# EasyEDA Pro project 空调遥控板.epro

# Schematic 空调遥控板
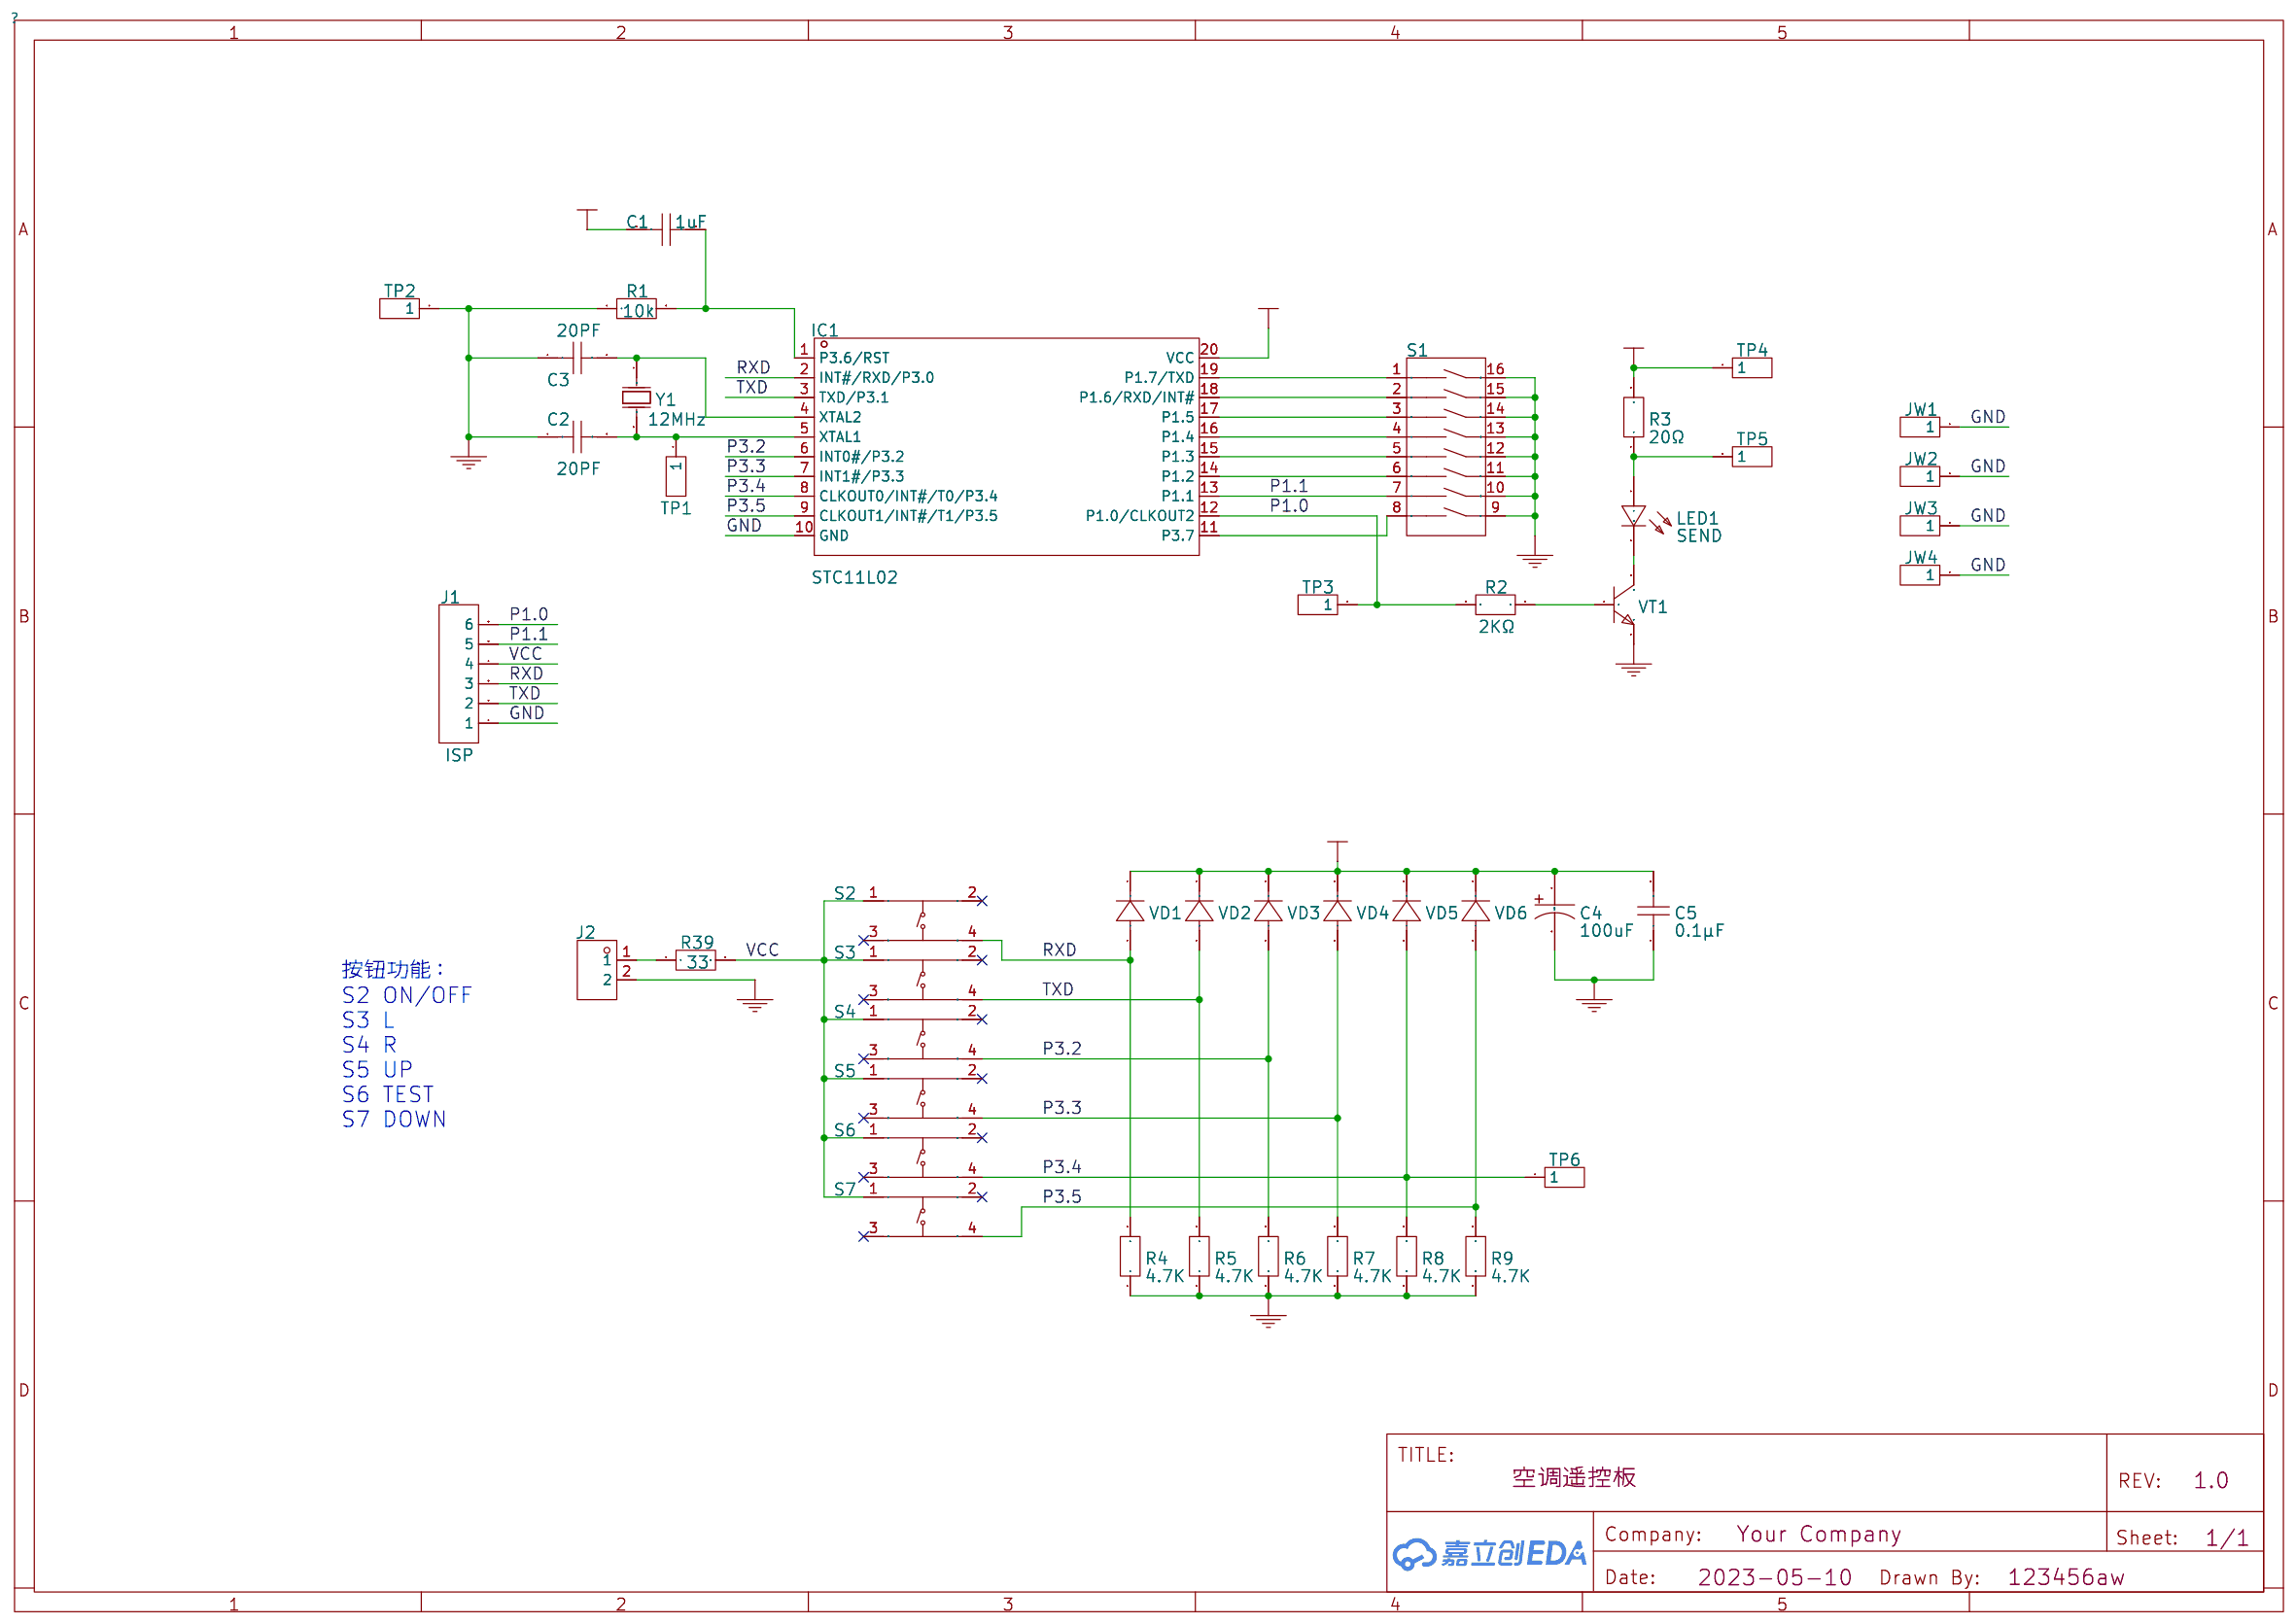
[diagram p0: schematic sheet]

## Parts
C1  1uF  [C0805]
C2  20PF  [C0805]
C3  20PF  [C0805]
C4  100uF  [CASE-C_6032]
C5  0.1μF  [C0805]
IC1  STC11L02  [SOIC-20_L13.0-W7.6-P1.27-LS10.3-BL]
J1  ISP  [HDR-F-2.54_1X6]
J2  +3V GND  [CONN-TH_HX20020-2A]
JW1  HDR-M-2.54_1x1  [焊盘M3]
JW2  HDR-M-2.54_1x1  [焊盘M3]
JW3  HDR-M-2.54_1x1  [焊盘M3]
JW4  HDR-M-2.54_1x1  [焊盘M3]
LED1  SEND  [LED-TH_BD3.9-P2.54-FD]
R1  10k  [R0805]
R2  2KΩ  [R0805]
R3  20Ω  [RES-TH_BD3.5-L9.0-P13.00-D0.5]
R4  4.7K  [R0805]
R5  4.7K  [R0805]
R6  4.7K  [R0805]
R7  4.7K  [R0805]
R8  4.7K  [R0805]
R9  4.7K  [R0805]
R39  33  [R0805]
S1  ADD  [SW-TH_16P-L21.9-W9.9-P2.54-LS7.8]
S2  ON/OFF  [SW-TH_4P-L6.0-W6.0-P4.50-LS6.5]
S3  L  [SW-TH_4P-L6.0-W6.0-P4.50-LS6.5]
S4  R  [SW-TH_4P-L6.0-W6.0-P4.50-LS6.5]
S5  UP  [SW-TH_4P-L6.0-W6.0-P4.50-LS6.5]
S6  TEST  [SW-TH_4P-L6.0-W6.0-P4.50-LS6.5]
S7  DOWM  [SW-TH_4P-L6.0-W6.0-P4.50-LS6.5]
TP1  XTAL  [HDR-M-2.54_1X1]
TP2  GND  [HDR-M-2.54_1X1]
TP3  SEND  [HDR-M-2.54_1X1]
TP4  VCC  [HDR-M-2.54_1X1]
TP5  RS  [HDR-M-2.54_1X1]
TP6  TEST  [HDR-M-2.54_1X1]
VD1  1N5819_C9900008009  [SMA_L4.3-W2.6-LS5.1-RD]
VD2  1N5819_C9900008009  [SMA_L4.3-W2.6-LS5.1-RD]
VD3  1N5819_C9900008009  [SMA_L4.3-W2.6-LS5.1-RD]
VD4  1N5819_C9900008009  [SMA_L4.3-W2.6-LS5.1-RD]
VD5  1N5819_C9900008009  [SMA_L4.3-W2.6-LS5.1-RD]
VD6  1N5819_C9900008009  [SMA_L4.3-W2.6-LS5.1-RD]
VT1  S8050_C105433  [SOT-23-3_L2.9-W1.6-P1.90-LS2.8-BR]
Y1  12MHz  [HC-49US_L11.5-W4.5-P4.88]

## Library data of the parts
C1 = 1uF: link: https://item.szlcsc.com/373011.html; 3DModel: C0805_L2.0-W1.3-H1.3
C2 C3 = 20PF: link: https://item.szlcsc.com/373011.html; 3DModel: C0805_L2.0-W1.3-H1.3
C4 = 100uF: link: https://atta.szlcsc.com/upload/public/pdf/source/20191107/C444803_2AE3212B584342380EA93CBE13ACED9E.pdf; 3DModel: CASE-C_L6.0-W3.2-H2.7; Supplier: LCSC; Supplier Part: C273664; Manufacturer: Kyocera AVX; Manufacturer Part: F931C107KCC; JLCPCB Part Class: Extended Part
C5 = 0.1μF: link: https://item.szlcsc.com/373011.html; 3DModel: C0805_L2.0-W1.3-H1.3
IC1 = STC11L02: link: https://so.szlcsc.com/global.html?k=C32412&amp;ref=editor; 3DModel: SOIC-20_L12.8-W7.5-H2.7-LS10.3-P1.27; Supplier: LCSC; Manufacturer: STC(宏晶); Supplier Part: C32412; JLCPCB Part Class: Extended Part
J1 = ISP: 3DModel: HDR-F-2.54_1x6; Supplier Part: C40877; Supplier: LCSC
J2 = +3V GND: link: https://atta.szlcsc.com/upload/public/pdf/source/20191028/C442244_ED004195E24C4D1398292F4311E4E6E7.pdf; Supplier: LCSC; Supplier Part: C442244; Manufacturer: HX(红星); Manufacturer Part: HX20020-2A; JLCPCB Part Class: Extended Part
JW1-JW4 = HDR-M-2.54_1x1: Supplier Part: C81276; Supplier: LCSC
LED1 = SEND: link: https://item.szlcsc.com/366009.html; 3DModel: LED-TH-3mm_R; Supplier: LCSC; Manufacturer: EVERLIGHT(亿光); Manufacturer Part: IR204C-A-L; Supplier Part: C98863; JLCPCB Part Class: Extended Part
R1 = 10k: link: https://item.szlcsc.com/142685.html; 3DModel: R0805_L2.0-W1.3-H0.6
R2 = 2KΩ: link: https://item.szlcsc.com/142685.html; 3DModel: R0805_L2.0-W1.3-H0.6
R3 = 20Ω: link: https://atta.szlcsc.com/upload/public/pdf/source/20200609/C601736_823D5FEC32C33ED68EDB1181C52D1F38.pdf; Supplier: LCSC; Supplier Part: C601822; Manufacturer: VO(翔胜); Manufacturer Part: KNP1/2W-51Ω±5%-XT52
R4-R9 = 4.7K: link: https://item.szlcsc.com/142685.html; 3DModel: R0805_L2.0-W1.3-H0.6
R39 = 33: link: https://item.szlcsc.com/142685.html; 3DModel: R0805_L2.0-W1.3-H0.6
S1 = ADD: link: https://img.jlc.com/image//data/smt-stock-produce/componentSizePhoto/2022-01-10/20de4d79767c4f13a7ca3c4356335101/BG2201070020_D21122300030_font.png; Supplier: LCSC; Supplier Part: C9900005795; Manufacturer: null; Manufacturer Part: 2.54插件8位拨码开关; JLCPCB Part Class: Extended Part
S2 = ON/OFF: link: https://item.szlcsc.com/14483.html; 3DModel: SW-TH_4P-L6.0-W6.0-H5.0-LS6.5-P4.50; Supplier: LCSC; Supplier Part: C393938; Manufacturer: SHOU HAN(首韩); Manufacturer Part: TS665CJ; JLCPCB Part Class: Extended Part
S3 = L: link: https://item.szlcsc.com/14483.html; 3DModel: SW-TH_4P-L6.0-W6.0-H5.0-LS6.5-P4.50; Supplier: LCSC; Supplier Part: C393938; Manufacturer: SHOU HAN(首韩); Manufacturer Part: TS665CJ; JLCPCB Part Class: Extended Part
S4 = R: link: https://item.szlcsc.com/14483.html; 3DModel: SW-TH_4P-L6.0-W6.0-H5.0-LS6.5-P4.50; Supplier: LCSC; Supplier Part: C393938; Manufacturer: SHOU HAN(首韩); Manufacturer Part: TS665CJ; JLCPCB Part Class: Extended Part
S5 = UP: link: https://item.szlcsc.com/14483.html; 3DModel: SW-TH_4P-L6.0-W6.0-H5.0-LS6.5-P4.50; Supplier: LCSC; Supplier Part: C393938; Manufacturer: SHOU HAN(首韩); Manufacturer Part: TS665CJ; JLCPCB Part Class: Extended Part
S6 = TEST: link: https://item.szlcsc.com/14483.html; 3DModel: SW-TH_4P-L6.0-W6.0-H5.0-LS6.5-P4.50; Supplier: LCSC; Supplier Part: C393938; Manufacturer: SHOU HAN(首韩); Manufacturer Part: TS665CJ; JLCPCB Part Class: Extended Part
S7 = DOWM: link: https://item.szlcsc.com/14483.html; 3DModel: SW-TH_4P-L6.0-W6.0-H5.0-LS6.5-P4.50; Supplier: LCSC; Supplier Part: C393938; Manufacturer: SHOU HAN(首韩); Manufacturer Part: TS665CJ; JLCPCB Part Class: Extended Part
TP1 = XTAL: 3DModel: HDR-M-2.54_1x1; Supplier Part: C81276; Supplier: LCSC
TP2 = GND: 3DModel: HDR-M-2.54_1x1; Supplier Part: C81276; Supplier: LCSC
TP3 = SEND: 3DModel: HDR-M-2.54_1x1; Supplier Part: C81276; Supplier: LCSC
TP4 = VCC: 3DModel: HDR-M-2.54_1x1; Supplier Part: C81276; Supplier: LCSC
TP5 = RS: 3DModel: HDR-M-2.54_1x1; Supplier Part: C81276; Supplier: LCSC
TP6 = TEST: 3DModel: HDR-M-2.54_1x1; Supplier Part: C81276; Supplier: LCSC
VD1-VD6 = 1N5819_C9900008009: link: https://atta.szlcsc.com/upload/public/pdf/source/20180709/C223994_0992A17B371532752A8F64061563D908.pdf; Supplier: LCSC; Supplier Part: C9900008009; Manufacturer: null; Manufacturer Part: 1N5819; JLCPCB Part Class: Extended Part
VT1 = S8050_C105433: link: https://item.szlcsc.com/14454.html; 3DModel: SOT-23-3L_L2.9-W1.6-H1.1-LS2.8-P0.95; Supplier: LCSC; Manufacturer: CJ(江苏长电/长晶); Manufacturer Part: S8050; Supplier Part: C105433; JLCPCB Part Class: Extended Part
Y1 = 12MHz: link: https://lcsc.com/product-detail/DIP-Crystal-Resonators_Made-in-China-Made-in-China-37-5Mhz-20PF-20PPM_C52062.html; 3DModel: HC-49US_L11.0-W4.5-H3.5-P4.88; Supplier: LCSC; Manufacturer: YXC(扬兴晶振); Manufacturer Part: X49SD12MSD2SC; Supplier Part: C16369; JLCPCB Part Class: Extended Part

## Nets
GND: C2.1 C3.1 C4.2 C5.1 IC1.10(GND) J1.1 J2.2 JW1.1 JW2.1 JW3.1 JW4.1 R1.1 R4.1 R5.1 R6.1 R7.1 R8.1 R9.1 S1.9 S1.10 S1.11 S1.12 S1.13 S1.14 S1.15 S1.16 TP2.1 VT1.2
VCC: C1.1 C4.1 C5.2 IC1.20(VCC) J1.4 R3.2 R39.2 S2.1(A) S3.1(A) S4.1(A) S5.1(A) S6.1(A) S7.1(A) TP4.1 VD1.1(K) VD2.1(K) VD3.1(K) VD4.1(K) VD5.1(K) VD6.1(K)
P1.0: IC1.12(P1.0/CLKOUT2) J1.6 R2.2 TP3.1
P1.1: IC1.13(P1.1) J1.5 S1.7
P3.2: IC1.6(INT0#/P3.2) R6.2 S4.4(D) VD3.2(A)
P3.3: IC1.7(INT1#/P3.3) R7.2 S5.4(D) VD4.2(A)
P3.4: IC1.8(CLKOUT0/INT#/T0/P3.4) R8.2 S6.4(D) TP6.1 VD5.2(A)
P3.5: IC1.9(CLKOUT1/INT#/T1/P3.5) R9.2 S7.4(D) VD6.2(A)
RXD: IC1.2(INT#/RXD/P3.0) J1.3 R4.2 S2.4(D) VD1.2(A)
TXD: IC1.3(TXD/P3.1) J1.2 R5.2 S3.4(D) VD2.2(A)
J2_1: J2.1 R39.1
R1_2: C1.2 IC1.1(P3.6/RST) R1.2
R2_1: R2.1 VT1.1
S1_1: IC1.19(P1.7/TXD) S1.1
S1_2: IC1.18(P1.6/RXD/INT#) S1.2
S1_3: IC1.17(P1.5) S1.3
S1_4: IC1.16(P1.4) S1.4
S1_5: IC1.15(P1.3) S1.5
S1_6: IC1.14(P1.2) S1.6
S1_8: IC1.11(P3.7) S1.8
TP5_1: LED1.1(A) R3.1 TP5.1
VT1_3: LED1.2(C) VT1.3
Y1_1: C3.2 IC1.4(XTAL2) Y1.1(OSC1)
Y1_2: C2.2 IC1.5(XTAL1) TP1.1 Y1.2(OSC2)

Not connected (* = marked no-connect by the designer): S2 2(B)* 3(C)*; S3 2(B)* 3(C)*; S4 2(B)* 3(C)*; S5 2(B)* 3(C)*; S6 2(B)* 3(C)*; S7 2(B)* 3(C)*

## Notes on the sheet
- 按钮功能：
  S2 ON/OFF
  S3 L
  S4 R
  S5 UP
  S6 TEST
  S7 DOWN

# Board 1-PCB_PCB_空调遥控
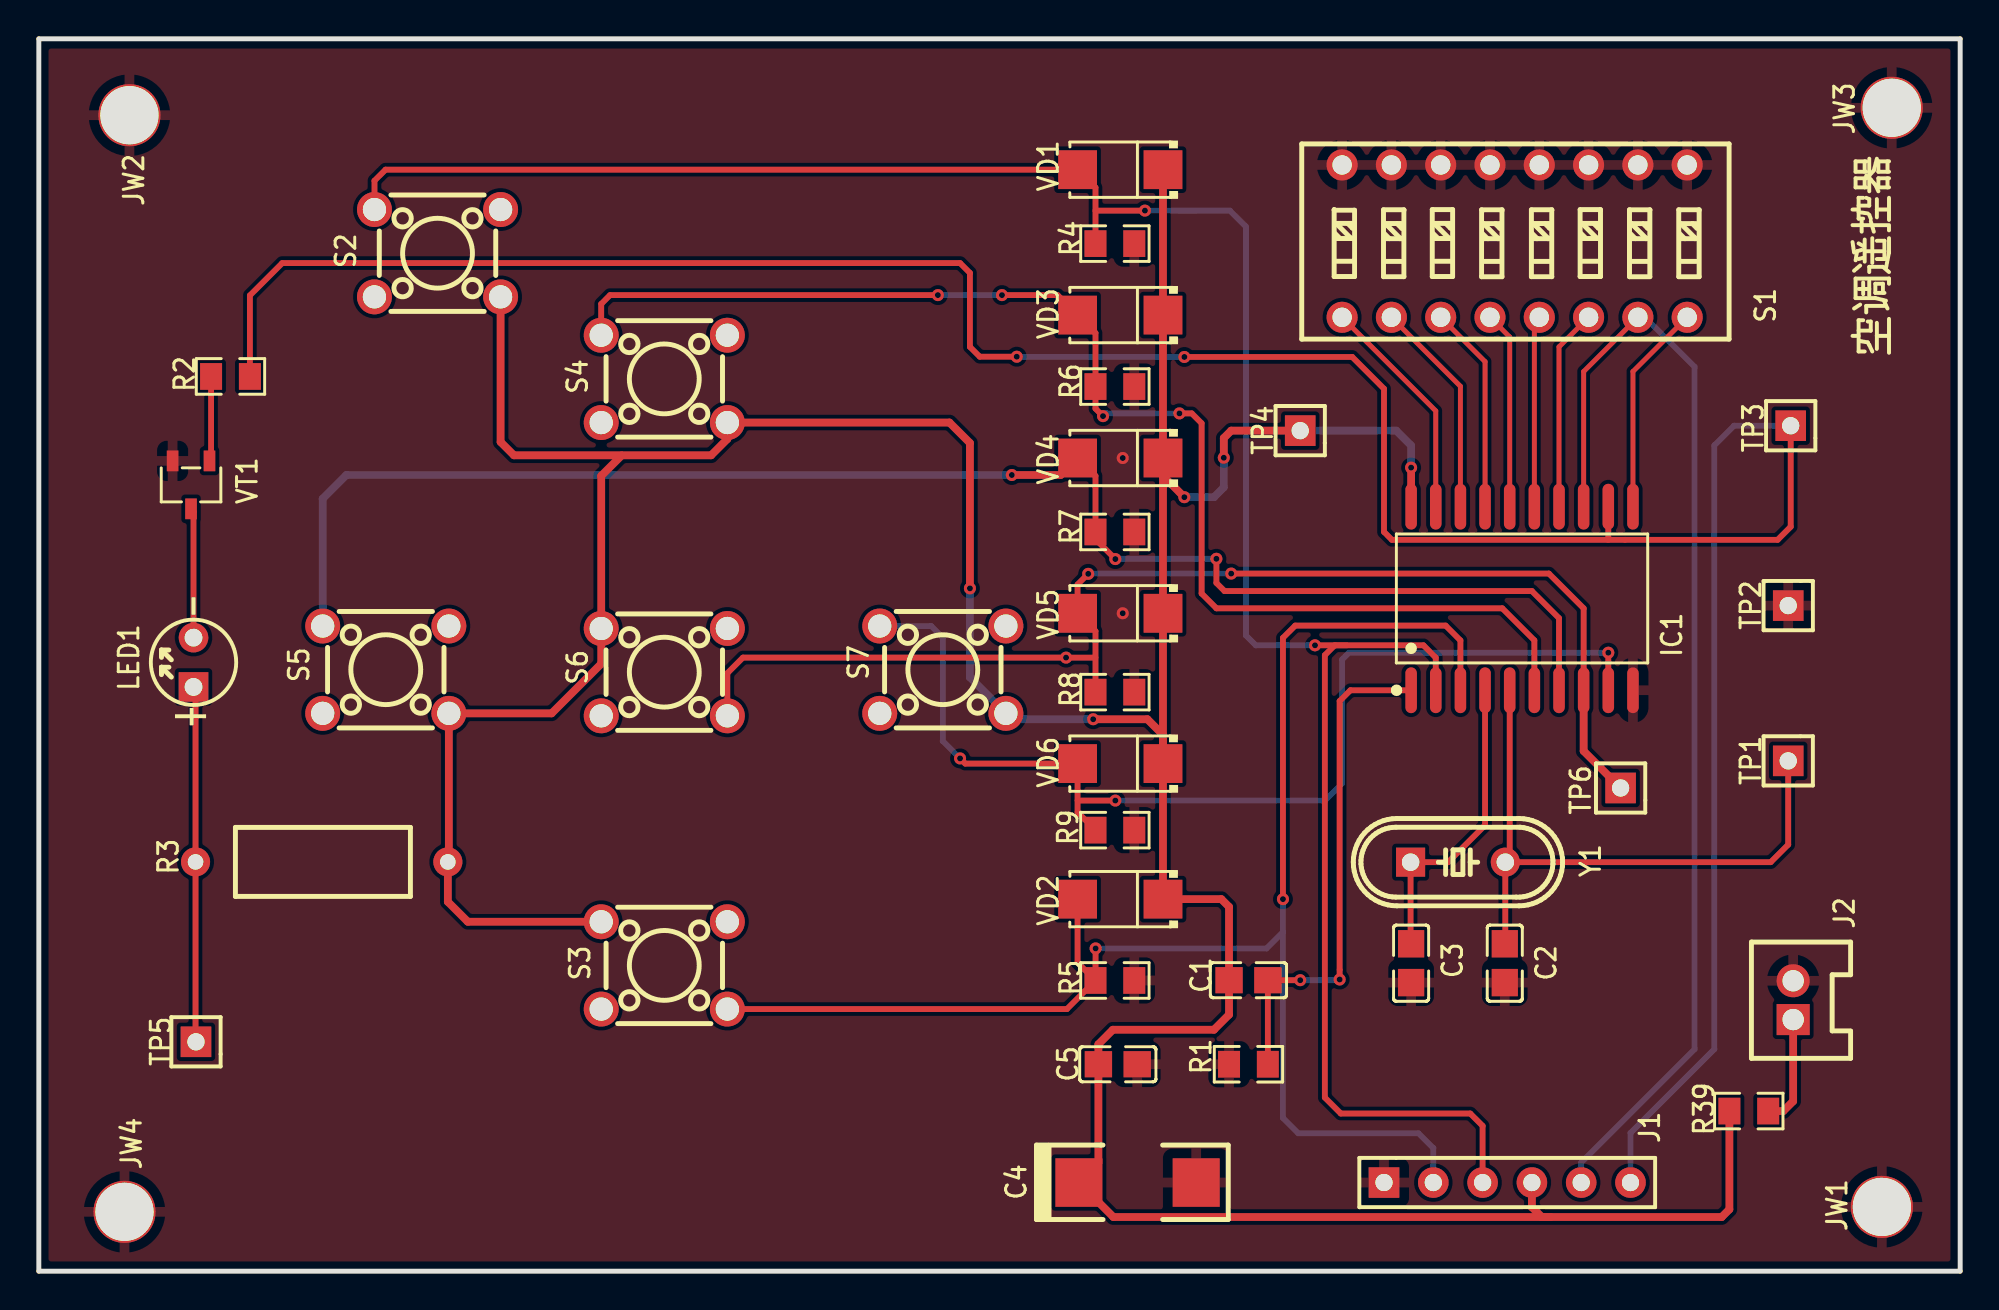
[diagram p1: board, top side]
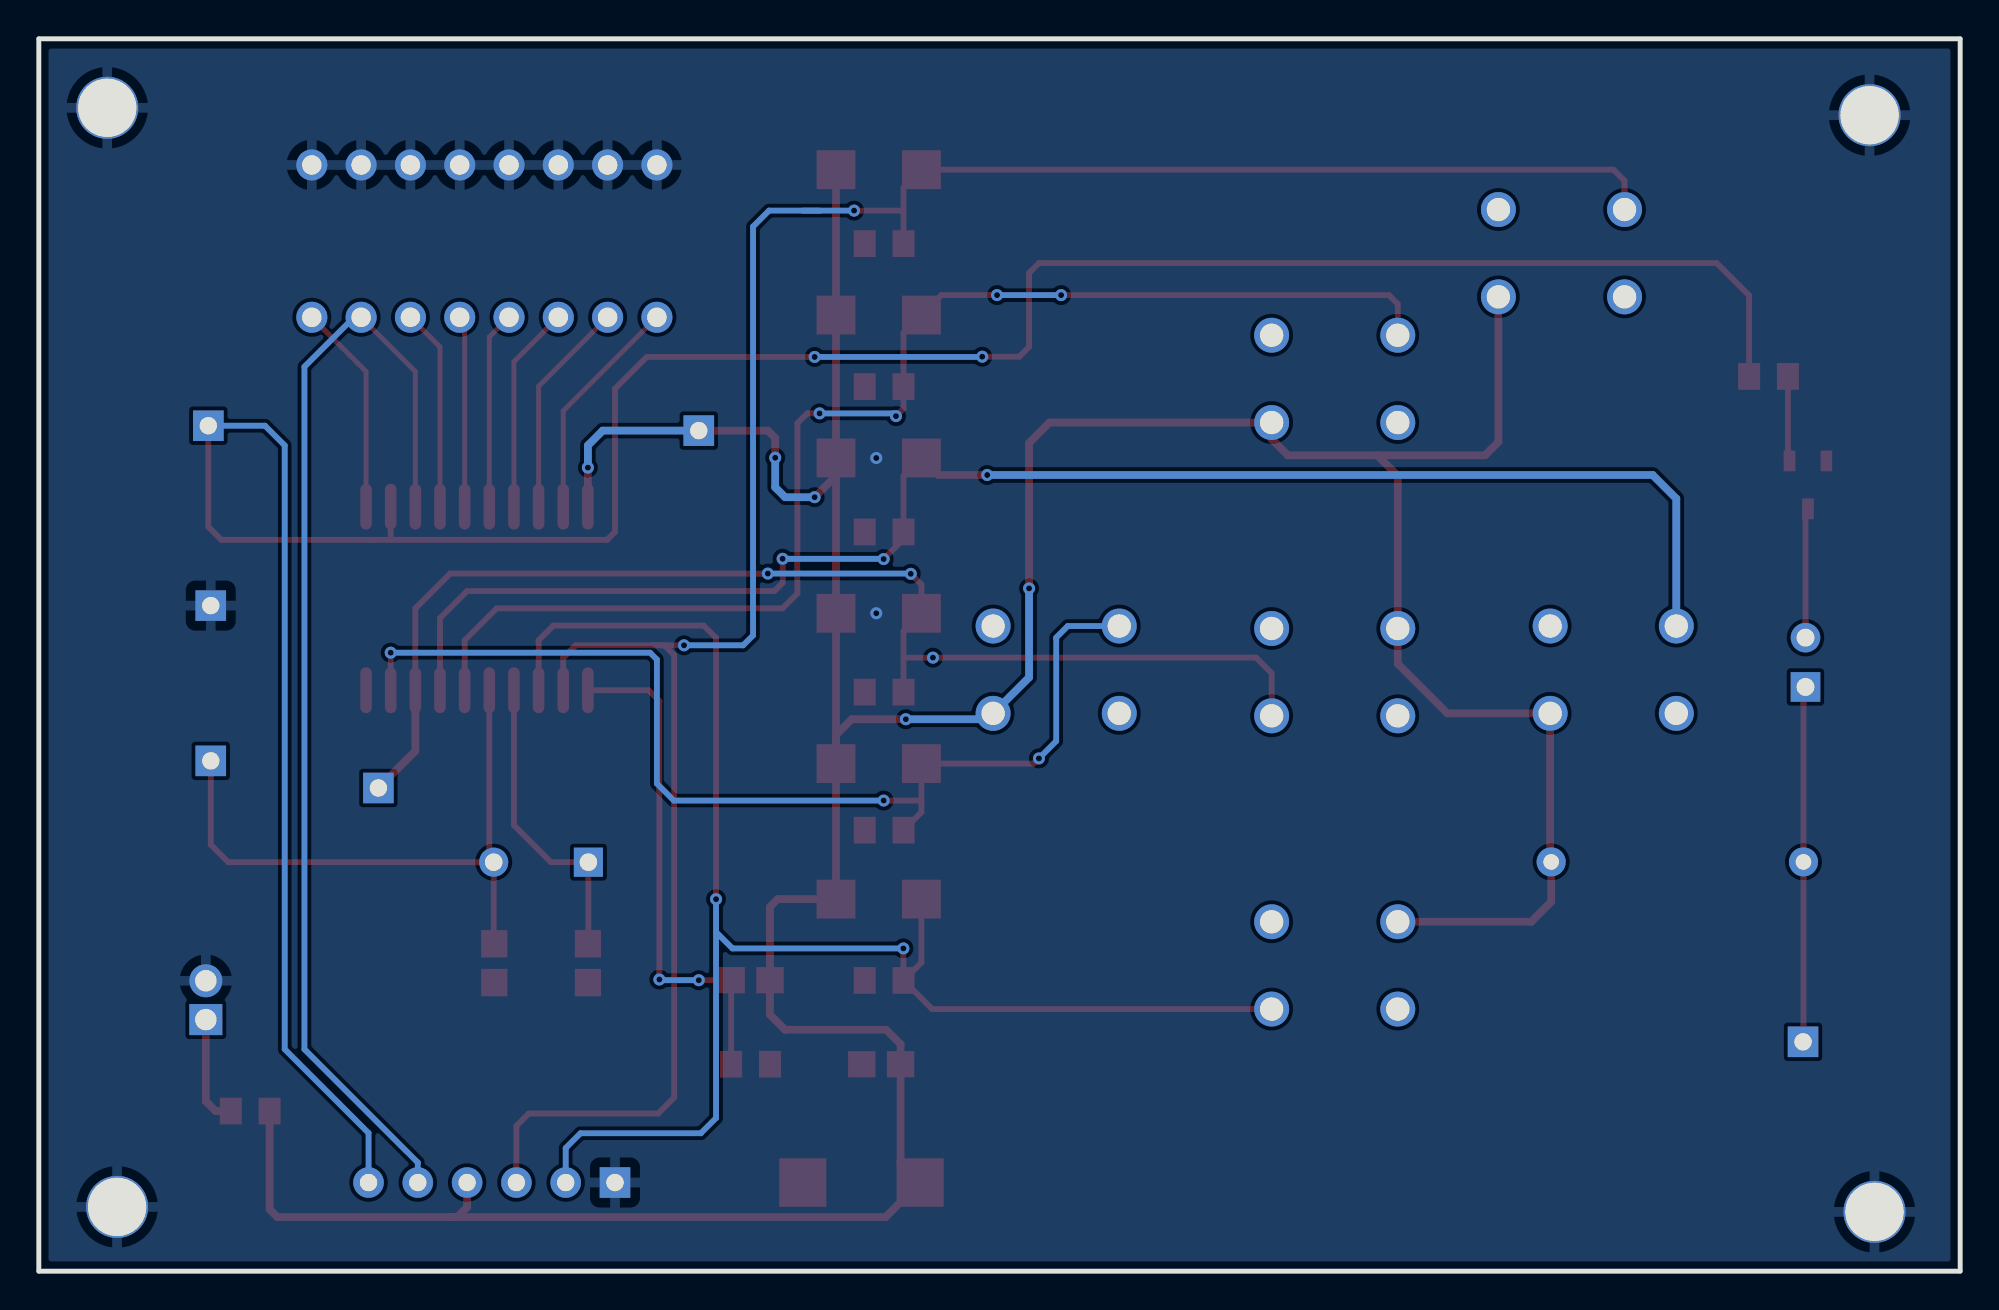
[diagram p2: board, bottom side, seen from below]

Outline 99 x 63.51 mm; copper layers: Top Layer, Bottom Layer. Coordinates in mm from the lower left corner of the outline.
Outline path: 0,63.51 99,63.51 99,0 0,0 0,63.51
Stack: Top Layer 0.035mm / Dielectric1 1.51mm FR4 er 4.5 / Bottom Layer 0.035mm

## Design rules (mm)
spacing Default (default): track to track 0.152, other pairs 0 to 0.152
spacing VCC: track to track 0.152, other pairs 0 to 0.152
track width Default (default): min 0.254, default 0.254, max 25.4
track width VCC: min 0.254, default 0.254, max 25.4
differential pair differentialPair (default): width min 0.127, default 0.254, max 2.54; gap min 0.152, default 0.152
via Default (default): diameter min 0.61, default 0.61, max 100.025; hole min 0.305, default 0.305, max 59.995
via VCC: diameter min 0.62, default 0.62, max 100.025; hole min 0.305, default 0.305, max 59.995
net VCC uses VCC
net GND uses gge53363
pour e57 uses gge49170
pour e58 uses gge53369
pour e243 uses gge53363

## Placement (name value [footprint] x y rotation side)
C1  1uF  [C0805]  62.33 15 0 top
C2  20PF  [C0805]  75.53 15.87 90 top
C3  20PF  [C0805]  70.71 15.87 90 top
C4  100uF  [CASE-C_6032]  56.61 4.57 180 top
C5  0.1μF  [C0805]  55.6 10.66 180 top
IC1  STC11L02  [SOIC-20_L13.0-W7.6-P1.27-LS10.3-BL]  76.42 34.67 0 top
J1  ISP  [HDR-F-2.54_1X6]  74.39 4.57 0 top
J2  +3V GND  [CONN-TH_HX20020-2A]  90.39 13.97 90 top
JW1  HDR-M-2.54_1x1  [焊盘M3]  94.71 3.44 0 top
JW2  HDR-M-2.54_1x1  [焊盘M3]  4.41 59.7 0 top
JW3  HDR-M-2.54_1x1  [焊盘M3]  95.22 60.08 0 top
JW4  HDR-M-2.54_1x1  [焊盘M3]  4.16 3.19 0 top
LED1  SEND  [LED-TH_BD3.9-P2.54-FD]  7.97 31.38 90 top
R1  10k  [R0805]  62.33 10.66 0 top
R2  2KΩ  [R0805]  9.88 46.11 0 top
R3  20Ω  [RES-TH_BD3.5-L9.0-P13.00-D0.5]  14.58 21.09 0 top
R4  4.7K  [R0805]  55.44 52.96 180 top
R5  4.7K  [R0805]  55.44 14.98 180 top
R6  4.7K  [R0805]  55.44 45.59 180 top
R7  4.7K  [R0805]  55.44 38.1 180 top
R8  4.7K  [R0805]  55.44 29.84 180 top
R9  4.7K  [R0805]  55.44 22.73 180 top
R39  33  [R0805]  88.11 8.25 180 top
S1  ADD  [SW-TH_16P-L21.9-W9.9-P2.54-LS7.8]  76.04 53.08 0 top
S2  ON/OFF  [SW-TH_4P-L6.0-W6.0-P4.50-LS6.5]  20.54 52.46 180 top
S3  L  [SW-TH_4P-L6.0-W6.0-P4.50-LS6.5]  32.23 15.76 0 top
S4  R  [SW-TH_4P-L6.0-W6.0-P4.50-LS6.5]  32.23 45.98 180 top
S5  UP  [SW-TH_4P-L6.0-W6.0-P4.50-LS6.5]  17.88 31 180 top
S6  TEST  [SW-TH_4P-L6.0-W6.0-P4.50-LS6.5]  32.23 30.87 0 top
S7  DOWM  [SW-TH_4P-L6.0-W6.0-P4.50-LS6.5]  46.58 31 180 top
TP1  XTAL  [HDR-M-2.54_1X1]  90.14 26.3 90 top
TP2  GND  [HDR-M-2.54_1X1]  90.14 34.3 90 top
TP3  SEND  [HDR-M-2.54_1X1]  90.27 43.57 0 top
TP4  VCC  [HDR-M-2.54_1X1]  64.99 43.32 0 top
TP5  RS  [HDR-M-2.54_1X1]  8.1 11.82 0 top
TP6  TEST  [HDR-M-2.54_1X1]  81.5 24.9 0 top
VD1  1N5819_C9900008009  [SMA_L4.3-W2.6-LS5.1-RD]  55.72 56.77 180 top
VD2  1N5819_C9900008009  [SMA_L4.3-W2.6-LS5.1-RD]  55.72 19.17 180 top
VD3  1N5819_C9900008009  [SMA_L4.3-W2.6-LS5.1-RD]  55.72 49.27 180 top
VD4  1N5819_C9900008009  [SMA_L4.3-W2.6-LS5.1-RD]  55.72 41.91 180 top
VD5  1N5819_C9900008009  [SMA_L4.3-W2.6-LS5.1-RD]  55.72 33.91 180 top
VD6  1N5819_C9900008009  [SMA_L4.3-W2.6-LS5.1-RD]  55.72 26.16 180 top
VT1  S8050_C105433  [SOT-23-3_L2.9-W1.6-P1.90-LS2.8-BR]  7.84 40.52 90 top
Y1  12MHz  [HC-49US_L11.5-W4.5-P4.88]  73.12 21.08 0 top

## Footprints (pads in the part's own frame, mm; a bottom-side part is the same pattern mirrored in y, then rotated)
C0805
  rect 1.41x1.35 smd: 1(-1,0) 2(1,0)
CASE-C_6032
  rect 2.425x2.5 smd: 1(3.022,0) 2(-3.022,0)
CONN-TH_HX20020-2A
  rect 1.6x1.7 hole 1.1: 1(-1,0)
  round 1.7 hole 1.1: 2(1,0)
HC-49US_L11.5-W4.5-P4.88
  rect 1.5x1.5 hole 0.9: 1(-2.44,0)
  round 1.5 hole 0.9: 2(2.44,0)
HDR-F-2.54_1X6
  rect 1.575x1.575 hole 0.889: 1(-5.08,0)
  round 1.575 hole 0.889: 2(-2.54,0) 3(0,0) 4(2.54,0) 5(5.08,0) 6(7.62,0)
HDR-M-2.54_1X1
  rect 1.575x1.575 hole 0.889: 1(0,0)
LED-TH_BD3.9-P2.54-FD
  rect 1.524x1.524 hole 0.914: 1(-1.27,0)
  round 1.524 hole 0.914: 2(1.27,0)
R0805
  rect 1.133x1.377 smd: 1(-1,0) 2(1,0)
RES-TH_BD3.5-L9.0-P13.00-D0.5
  round 1.5 hole 0.8: 1(-6.5,0) 2(6.5,0)
SMA_L4.3-W2.6-LS5.1-RD
  rect 2x2 smd: 1(-2.2,0) 2(2.2,0)
SOIC-20_L13.0-W7.6-P1.27-LS10.3-BL
  oval 0.595x2.36 smd: 1(-5.715,-4.73) 2(-4.445,-4.73) 3(-3.175,-4.73) 4(-1.905,-4.73) 5(-0.635,-4.73) 6(0.635,-4.73) 7(1.905,-4.73) 8(3.175,-4.73) 9(4.445,-4.73) 10(5.715,-4.73) 11(5.715,4.73) 12(4.445,4.73) 13(3.175,4.73) 14(1.905,4.73) 15(0.635,4.73) 16(-0.635,4.73) 17(-1.905,4.73) 18(-3.175,4.73) 19(-4.445,4.73) 20(-5.715,4.73)
SOT-23-3_L2.9-W1.6-P1.90-LS2.8-BR
  rect 1.07x0.6 smd: 1(1.235,-0.95) 2(1.235,0.95) 3(-1.235,0)
SW-TH_4P-L6.0-W6.0-P4.50-LS6.5
  round 1.8 hole 1.2: 1(-3.25,2.25) 2(3.25,2.25) 3(-3.25,-2.25) 4(3.25,-2.25)
SW-TH_16P-L21.9-W9.9-P2.54-LS7.8
  round 1.6 hole 1: 1(-8.89,-3.925) 2(-6.35,-3.925) 3(-3.81,-3.925) 4(-1.27,-3.925) 5(1.27,-3.925) 6(3.81,-3.925) 7(6.35,-3.925) 8(8.89,-3.925) 9(8.89,3.925) 10(6.35,3.925) 11(3.81,3.925) 12(1.27,3.925) 13(-1.27,3.925) 14(-3.81,3.925) 15(-6.35,3.925) 16(-8.89,3.925)
焊盘M3
  round 3.2 hole 3: 1(0.254,-0.127)

## Nets
As in the schematic.

Pads without a net: S2 2 3; S3 2 3; S4 2 3; S5 2 3; S6 2 3; S7 2 3

## Via types
v1: diameter 0.62, hole 0.31, Top Layer to Bottom Layer, 28 vias

## Routing (per net, layer and track width the routed paths; a pad name or vN(x,y) marks a point on that pad's centre or on a via; arc(x,y) is an arc through that point)
GND:
  vias: v1(55.85,41.91) v1(55.85,33.91)
VCC: length 220.6
  Top Layer w0.4: J1.4 76.93,3.3 77.44,2.79 86.71,2.79 87.11,3.19 R39.2 ; VD6.1 57.92,27.64 57.12,28.44 v1(54.33,28.44) ; VD6.1 VD5.1 VD4.1 ; VD6.1 VD2.1 60.93,19.17 61.33,18.78 C1.1 ; v1(59.03,39.89) 57.92,40.99 VD4.1 ; S5.1 21.13,21.14 R3.2 21.08,19.04 22.1,18.01 28.98,18.01 ; S2.1 23.79,42.73 24.48,42.05 34.64,42.05 35.48,42.88 S4.1 46.92,43.73 47.98,42.68 v1(47.98,35.19) ; 28.98,33.12 28.98,31.3 26.42,28.75 21.13,28.75 ; VD1.1 VD3.1 VD4.1 ; 30.04,42.05 28.98,40.99 S6.1 ; 77.9,2.79 55.37,2.79 C4.1 54.6,5.57 C5.2 54.6,11.7 55.34,12.44 60.55,12.44 61.33,13.22 61.33,15 ; TP4.1 61.44,43.32 61.06,42.94 v1(61.06,41.92) ; 70.71,39.4 v1(70.71,41.41)
  Bottom Layer w0.4: v1(61.06,41.92) 61.06,40.4 60.55,39.89 v1(59.03,39.89) ; v1(47.98,35.19) 47.98,30.6 S7.1 50.13,28.44 v1(54.33,28.44) ; TP4.1 69.95,43.32 70.71,42.56 v1(70.71,41.41)
J2_1: length 5.7
  Top Layer w0.4: 90.39,12.97 90.39,8.76 89.89,8.25 R39.1
P1.0: length 148.1
  Top Layer w0.3: 59.03,47.11 67.67,47.11 69.31,45.48 69.31,38.1 69.72,37.69 89.59,37.69 90.27,38.36 TP3.1 ; 80.87,39.4 80.87,37.69 ; R2.2 10.88,50.29 12.54,51.95 47.47,51.95 47.98,51.45 47.98,47.64 48.48,47.13 v1(50.39,47.13)
  Bottom Layer w0.3: 82.01,4.56 82.01,7.12 86.33,11.44 86.33,42.56 87.35,43.57 TP3.1 ; v1(59.03,47.11) 50.4,47.11 v1(50.39,47.13)
P1.1: length 59.4
  Top Layer w0.254: 82.39,49.16 79.6,46.36 79.6,39.4
  Bottom Layer w0.3: S1.7 82.76,49.16 85.31,46.61 85.31,11.44 79.47,5.6 J1.5
P3.2: length 67.4
  Top Layer w0.3: v1(49.63,50.3) 52.49,50.3 VD3.2 54.44,48.35 R6.2 54.44,44.45 v1(54.83,44.07) ; S4.4 28.98,49.85 29.43,50.3 v1(46.32,50.3) ; IC1.6 77.06,32.51 75.41,34.16 60.68,34.16 59.91,34.92 59.91,43.7 59.41,44.21 v1(58.77,44.21)
  Bottom Layer w0.3: v1(54.83,44.07) 54.97,44.21 v1(58.77,44.21) ; v1(46.32,50.3) v1(49.63,50.3)
P3.3: length 80.9
  Top Layer w0.3: IC1.7 78.33,33.65 76.93,35.05 61.09,35.05 60.68,35.47 v1(60.68,36.71) ; VD4.2 54.44,40.98 R7.2 54.44,37.72 v1(55.47,36.7)
  Top Layer w0.4: v1(50.13,41.03) 52.65,41.03 VD4.2
  Bottom Layer w0.3: v1(55.47,36.7) 55.48,36.71 v1(60.68,36.71)
  Bottom Layer w0.4: S5.4 14.63,39.81 15.84,41.03 v1(50.13,41.03)
P3.4: length 64.5
  Top Layer w0.3: v1(61.44,35.95) 77.81,35.95 79.6,34.16 79.6,29.94 ; R8.2 54.44,32.98 VD5.2 53.52,35.39 v1(54.07,35.94) ; 35.48,28.62 35.48,30.82 36.28,31.62 52.93,31.62 ; v1(52.93,31.62) 54.44,31.62
  Top Layer w0.4: TP6.1 79.6,26.81 79.6,29.94
  Bottom Layer w0.3: v1(61.44,35.95) 54.09,35.95 v1(54.07,35.94)
P3.5: length 56.2
  Top Layer w0.3: v1(47.47,26.43) 47.74,26.16 VD6.2 53.52,23.65 R9.2 ; 80.87,29.94 v1(80.87,31.87) ; v1(55.47,24.25) 53.52,24.25
  Bottom Layer w0.3: v1(80.87,31.87) 67.5,31.87 67.15,31.52 67.15,25.13 66.28,24.25 v1(55.47,24.25) ; S7.4 45.98,33.25 46.58,32.65 46.58,27.31 v1(47.47,26.43)
R1_2: length 26.3
  Top Layer w0.3: v1(67.03,15.03) 67.03,29.38 67.58,29.94 70.71,29.94 ; v1(64.99,15) C1.2 R1.2
  Bottom Layer w0.3: v1(67.03,15.03) 66.99,15 v1(64.99,15)
R2_1: length 4.4
  Top Layer w0.3: R2.1 8.88,41.84 VT1.1
RXD: length 119.9
  Top Layer w0.3: 71.98,29.94 71.98,31.62 71.34,32.25 66.77,32.25 66.26,31.75 66.26,8.95 67.09,8.12 73.76,8.12 74.39,7.49 J1.3 ; 17.3,54.71 17.3,56.2 17.86,56.77 53.52,56.77 ; 54.44,54.66 v1(56.99,54.66) ; VD1.2 54.44,55.84 R4.2 ; 67.4,32.25 v1(65.76,32.25)
  Bottom Layer w0.3: v1(56.99,54.66) 59.66,54.66 ; 58.76,54.66 61.37,54.66 62.2,53.83 62.2,32.76 62.71,32.25 v1(65.76,32.25)
S1_1: length 11.8
  Top Layer w0.254: 71.98,39.4 71.98,44.33 S1.1
S1_2: length 11.2
  Top Layer w0.254: 73.25,39.4 73.25,45.6 S1.2
S1_3: length 10.7
  Top Layer w0.254: S1.3 74.52,46.87 74.52,39.4
S1_4: length 10.2
  Top Layer w0.254: S1.4 75.79,48.14 75.79,39.4
S1_5: length 9.9
  Top Layer w0.254: 77.06,39.4 77.06,48.9 S1.5
S1_6: length 10.4
  Top Layer w0.254: 78.33,39.4 78.33,47.63 S1.6
S1_8: length 10.9
  Top Layer w0.254: S1.8 82.14,46.36 82.14,39.4
TP5_1: length 18.3
  Top Layer w0.3: TP5.1 8.08,11.84 R3.1 8.08,30 LED1.1
TXD: length 83
  Top Layer w0.3: S3.4 52.97,13.51 R5.2 ; R5.2 53.52,15.9 VD2.2 ; R5.2 v1(54.45,16.63) ; 64.1,32.35 v1(64.1,19.17) ; 73.25,29.94 73.25,32.51 72.49,33.27 64.74,33.27 64.1,32.64 64.1,32.35
  Bottom Layer w0.3: 64.1,17.48 63.26,16.63 v1(54.45,16.63) ; v1(64.1,19.17) 64.1,7.89 64.89,7.11 71.09,7.11 71.85,6.35 J1.2
VT1_3: length 6.7
  Top Layer w0.3: VT1.3 7.97,39.16 LED1.2
Y1_1: length 16.1
  Top Layer w0.3: 70.71,17.13 70.71,16.87 70.68,16.9 Y1.1 72.61,21.08 74.52,22.98 74.52,29.94
Y1_2: length 32.4
  Top Layer w0.3: Y1.2 89.24,21.08 90.14,21.98 TP1.1 ; Y1.2 75.56,16.9 75.53,16.87 ; Y1.2 75.79,21.31 75.79,29.94

## Copper pours and planes (outline as drawn; the poured copper is in the pictures)
GND on Top Layer: -0.03,63.51 99.03,63.51 99.03,0.01 -0.03,0.01
GND on Bottom Layer: -0.03,63.51 99.03,63.51 99.03,0.01 -0.03,0.01
GND on Bottom Layer: -0.03,63.51 99.03,63.51 99.03,0.01 -0.03,0.01

## Text on the board
Top Silkscreen Layer: 空调遥控器
